# EAGLE schematic DIPDAP (EAGLE 7.3.0)
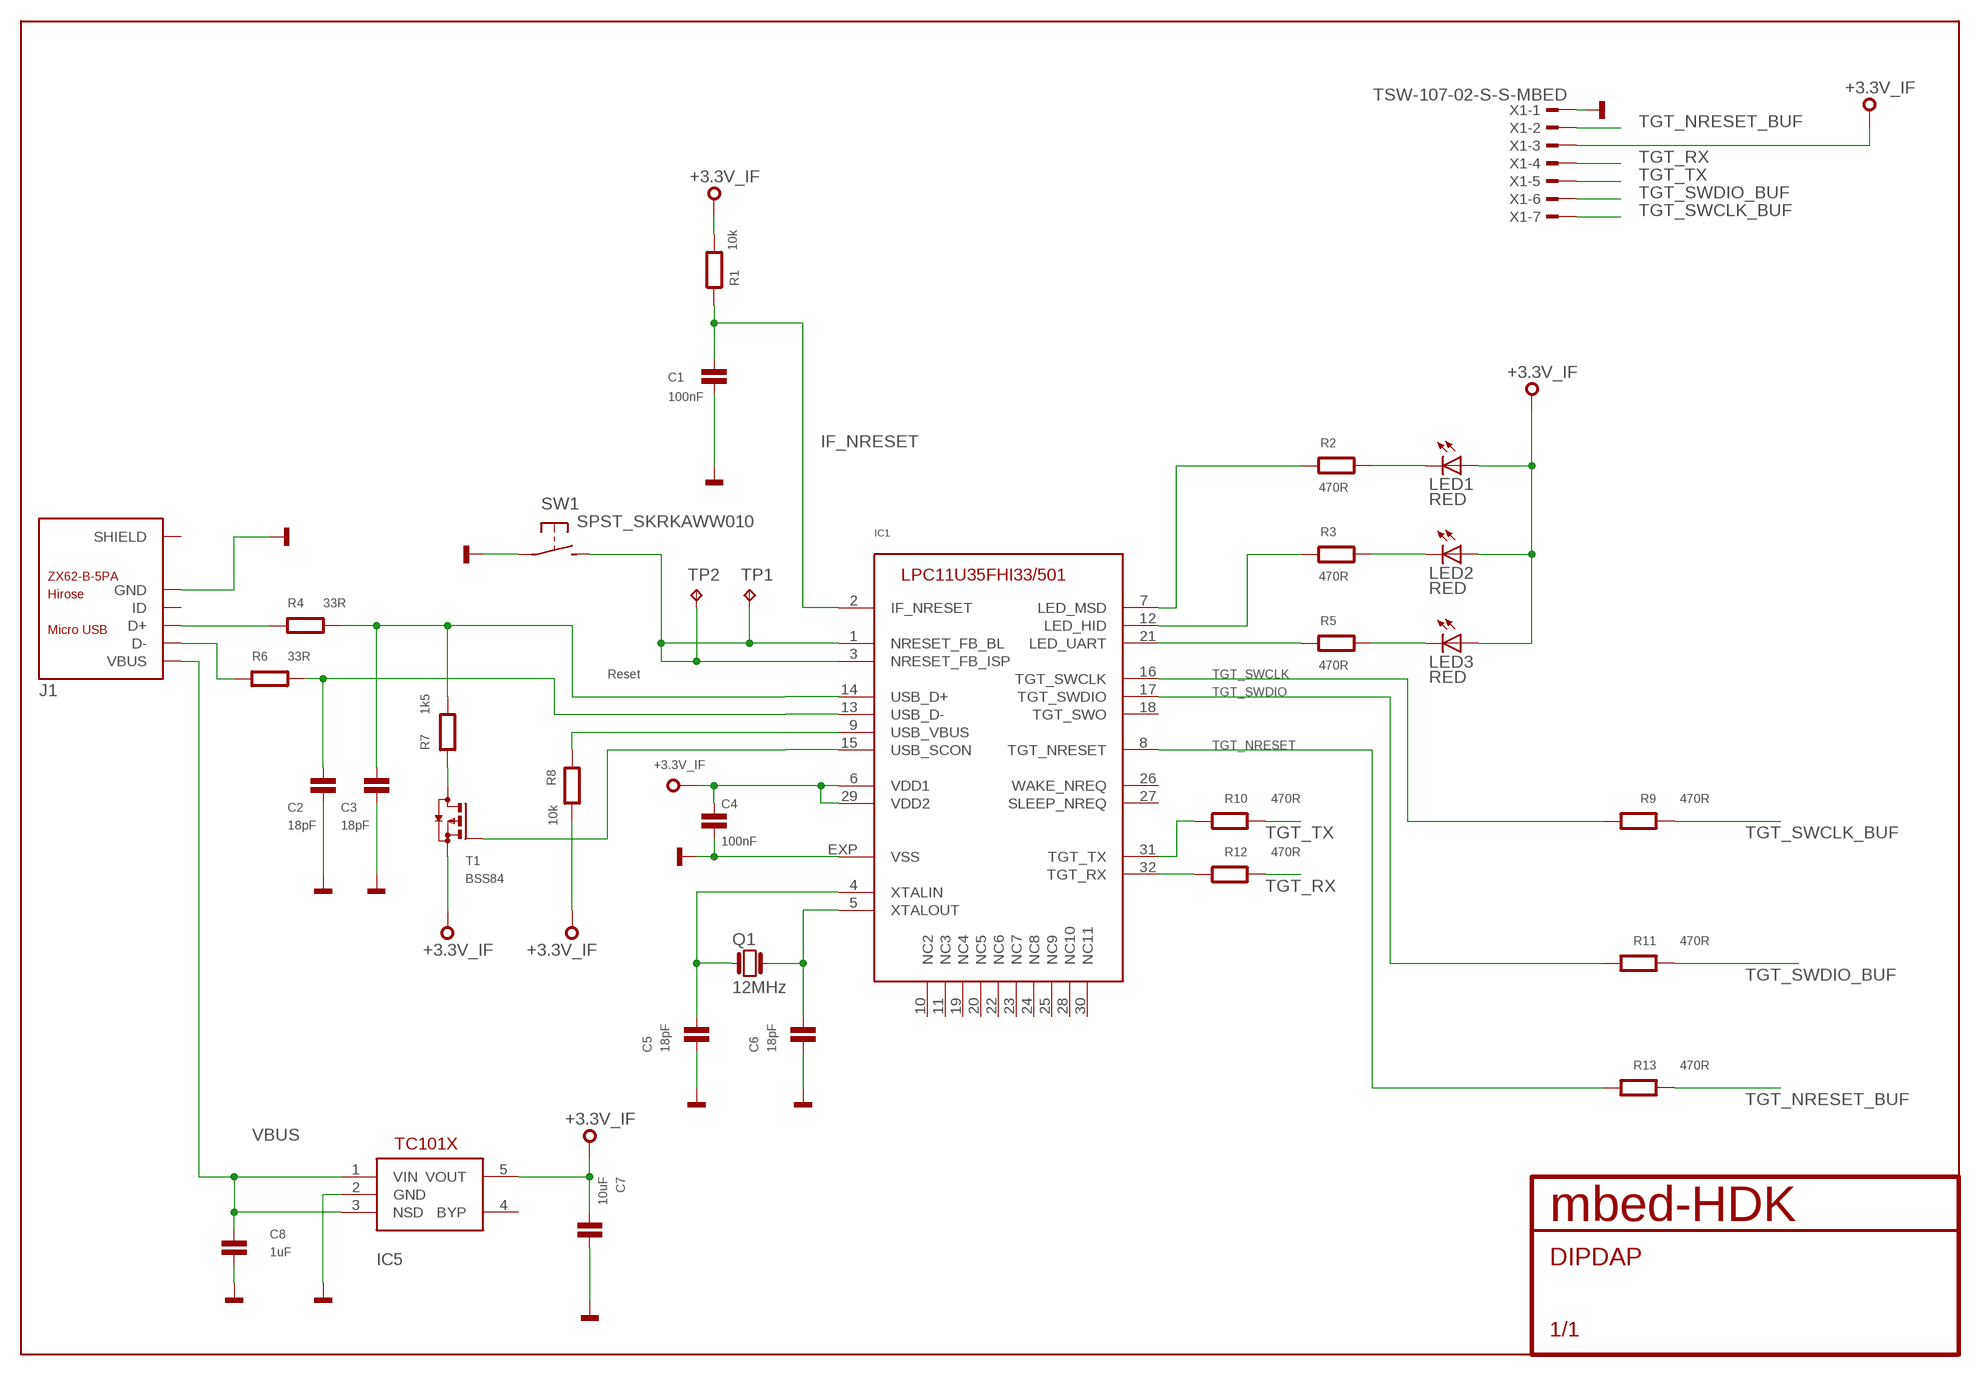
[diagram p0: schematic, sheet 1]

## Parts
C1  100nF  C0402  [0402]
C2  18pF  C0402  [0402]
C3  18pF  C0402  [0402]
C4  100nF  C0402  [0402]
C5  18pF  C0402  [0402]
C6  18pF  C0402  [0402]
C7  10uF  C0603  [0603]
C8  1uF  C0402  [0402]
IC1  IF-LPC11U35  [HVQFN33]
IC5  TC1014  [SOT23-5]
J1  ZX62-B-5PA  [ZX62-B-5PA(11)]
LED1  RED  LED0603  [CHIPLED_0603]
LED2  RED  LED0603  [CHIPLED_0603]
LED3  RED  LED0603  [CHIPLED_0603]
Q1  12MHz  Q_3.2X2.5  [3.2X.2.5]
R1  10k  R0402  [0402]
R2  470R  R0402  [0402]
R3  470R  R0402  [0402]
R4  33R  R0402  [0402]
R5  470R  R0402  [0402]
R6  33R  R0402  [0402]
R7  1k5  R0402  [0402]
R8  10k  R0402  [0402]
R9  470R  R0402  [0402]
R10  470R  R0402  [0402]
R11  470R  R0402  [0402]
R12  470R  R0402  [0402]
R13  470R  R0402  [0402]
SW1  SPST_SKRKAWW010  [SKRKAEE010]
T1  BSS84  [SOT23]
TP1  TPTP08SQ  [TP08SQ]
TP2  TPTP08SQ  [TP08SQ]
X1  TSW-107-02-S-S-MBED  [TSW-107-02-S-S-RA-MBED]

## Nets
+3,3V: C4.1 C7.2 IC1.6(VDD1) IC1.29(VDD2) IC5.5(VOUT) LED1.A LED2.A LED3.A R1.2 R8.2 T1.2(S) X1.3 ; supply symbol labelled +3.3V_IF
GND: C1.2 C2.2 C3.2 C4.2 C5.2 C6.2 C7.1 C8.1 IC1.EXP(VSS) IC5.2(GND) J1.5(GND) SW1.P$1(P) X1.1
HID: IC1.12(LED_HID) R3.2
IF_NRESET: C1.1 IC1.2(IF_NRESET) R1.1
ISP: IC1.1(NRESET_FB_BL) IC1.3(NRESET_FB_ISP) SW1.P$2(S) TP1.TP TP2.TP
MSD: IC1.7(LED_MSD) R2.2
N$1: C3.1 IC1.14(USB_D+) R4.2 R7.2
N$2: C2.1 IC1.13(USB_D-) R6.2
N$3: J1.2(D-) R6.1
N$4: J1.3(D+) R4.1
N$5: LED1.C R2.1
N$6: R7.1 T1.3(D)
N$7: IC1.9(USB_VBUS) R8.1
N$8: LED2.C R3.1
N$9: LED3.C R5.1
N$12: C6.1 IC1.5(XTALOUT) Q1.P$3
N$14: C5.1 IC1.4(XTALIN) Q1.P$1
N$19: IC1.15(USB_SCON) T1.1(G)
N$20: IC1.32(TGT_RX) R12.2
N$22: IC1.31(TGT_TX) R10.2
TGT_NRESET: IC1.8(TGT_NRESET) R13.2
TGT_NRESET_BUF: R13.1 X1.2
TGT_RX: R12.1 X1.4
TGT_SWCLK: IC1.16(TGT_SWCLK) R9.2
TGT_SWCLK_BUF: R9.1 X1.7
TGT_SWDIO: IC1.17(TGT_SWDIO) R11.2
TGT_SWDIO_BUF: R11.1 X1.6
TGT_TX: R10.1 X1.5
UART: IC1.21(LED_UART) R5.2
VBUS: C8.2 IC5.1(VIN) IC5.3(NSD) J1.1(VBUS)
Unconnected: IC1.10(NC2) IC1.11(NC3) IC1.18(TGT_SWO) IC1.19(NC4) IC1.20(NC5) IC1.22(NC6) IC1.23(NC7) IC1.24(NC8) IC1.25(NC9) IC1.26(WAKE_NREQ) IC1.27(SLEEP_NREQ) IC1.28(NC10) IC1.30(NC11) IC5.4(BYP) J1.4(ID) J1.SH1(SHIELD) J1.SH2(SHIELD) J1.SH3(SHIELD) J1.SH4(SHIELD) J1.SH5(SHIELD) J1.SH6(SHIELD)

## Notes on the sheet
- Reset

## Library data of the parts
C1-C8 = mbed-HDK:C: Capacitor
IC1 = mbed-HDK:IF-LPC11U35
IC5 = mbed-HDK:TC1014
J1 = hirose:ZX62-B-5PA
LED1-LED3 = mbed-HDK:LED: SMD LED
Q1 = mbed-HDK:Q
R1-R13 = mbed-HDK:R
SW1 = mbed-switches:SPST
T1 = mbed-HDK:BSS84: P-CHANNEL MOS FET
TP1 TP2 = testpad:TP: Test pad
X1 = mbed-connectors:TSW-107-02-S-S: THROUGH-HOLE .025" SQ POST HEADER Source: Samtec TSW.pdf